# EAGLE design SumoDuino (EAGLE 7.1.0)
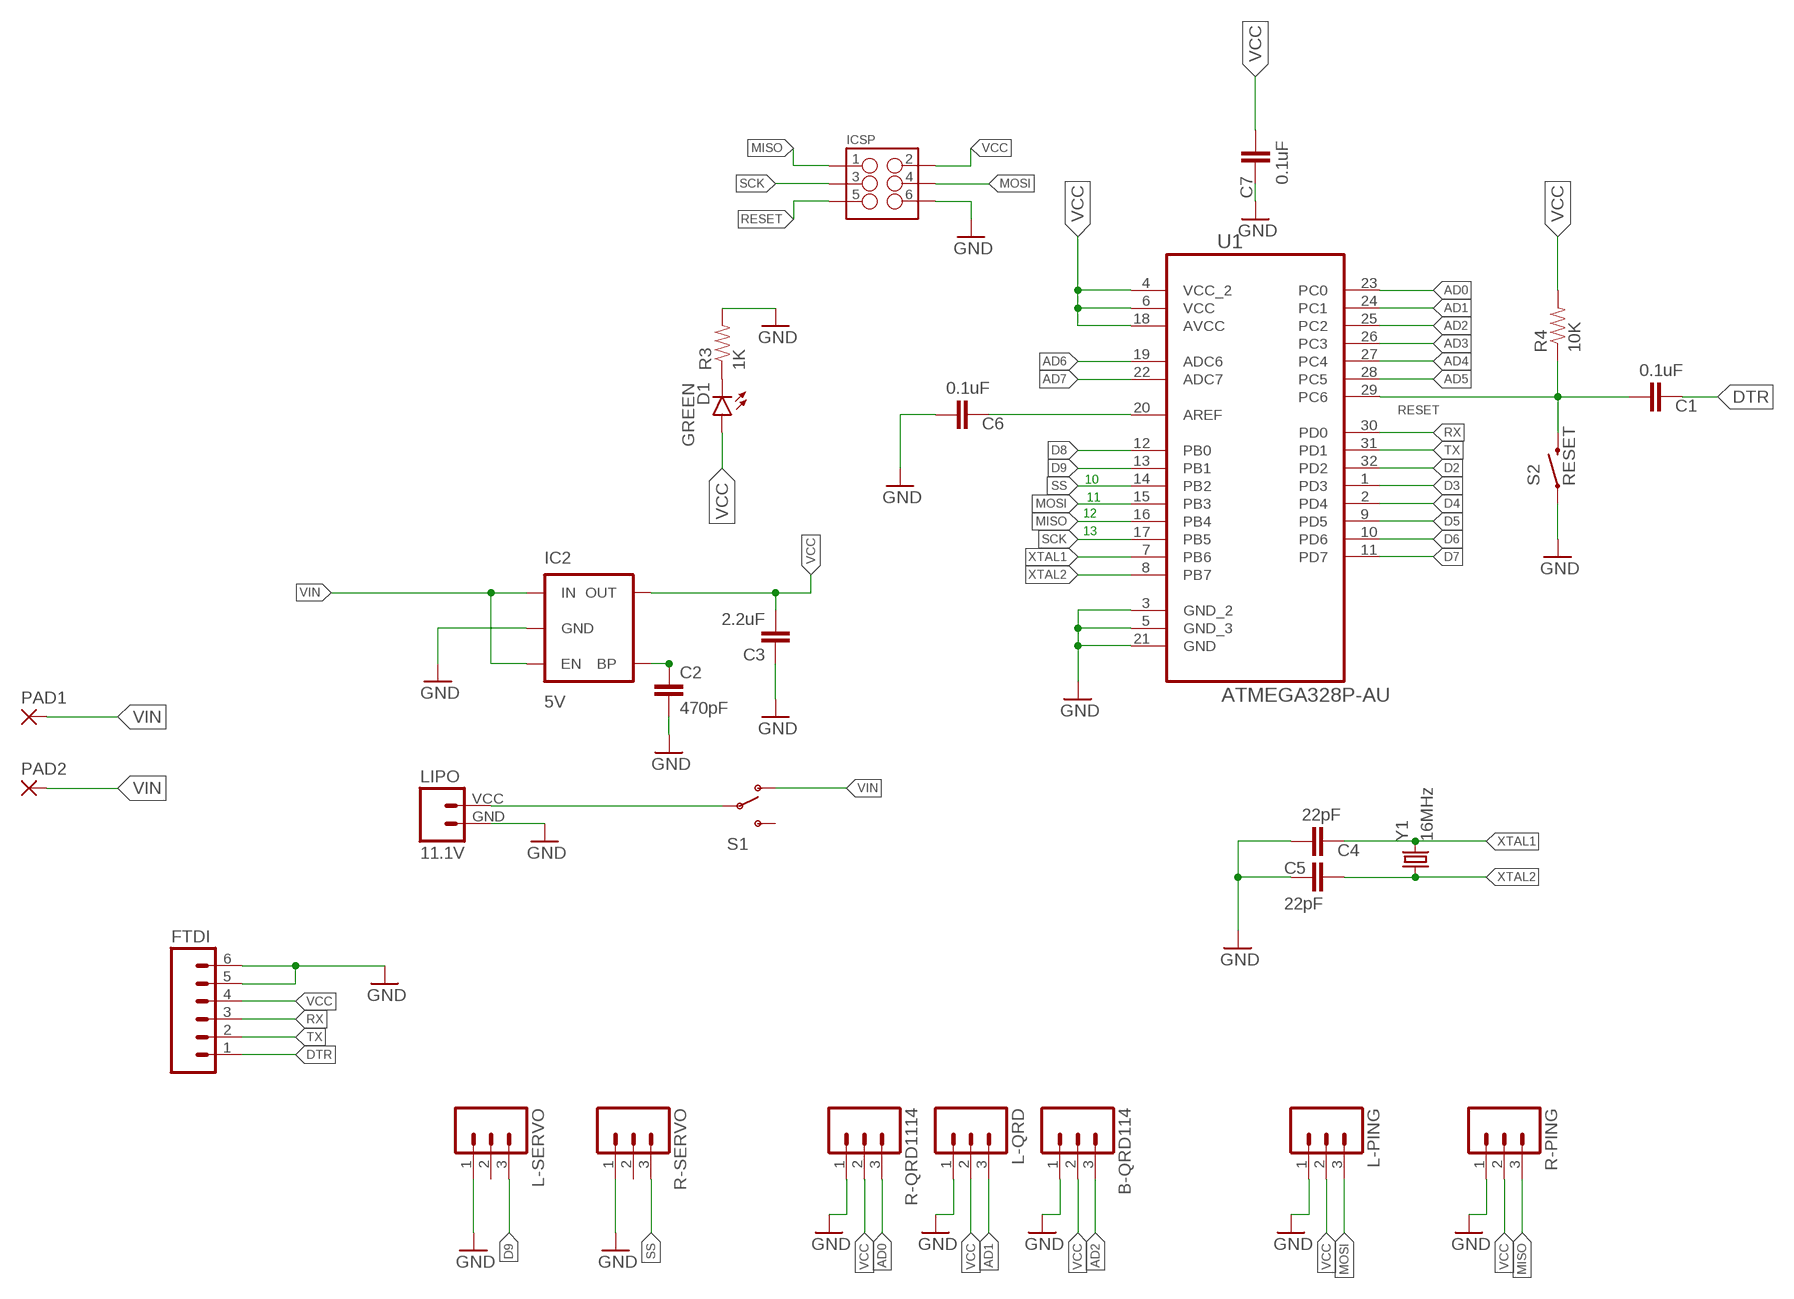
[diagram p0: schematic, sheet 1]

## Parts
B-QRD114  M03PTH  [1X03]
C1  0.1uF  CAP0603-CAP  [0603-CAP]
C2  470pF  CAP0603-CAP  [0603-CAP]
C3  2.2uF  CAP0603-CAP  [0603-CAP]
C4  22pF  CAP0603-CAP  [0603-CAP]
C5  22pF  CAP0603-CAP  [0603-CAP]
C6  0.1uF  CAP0603-CAP  [0603-CAP]
C7  0.1uF  CAP0603-CAP  [0603-CAP]
D1  GREEN  LED-GREEN0603  [LED-0603]
FTDI  M06LOCK  [1X06_LOCK]
IC2  5V  V_REG_MIC52055V  [SOT23-5]
ICSP  M03X22X3_SILK_MALE_PTH  [2X3]
L-PING  M03PTH  [1X03]
L-QRD  M03PTH  [1X03]
L-SERVO  M03PTH  [1X03]
LIPO  11.1V  M024UCON-15767  [JST-2-SMD-VERT]
PAD1  1,6/0,8  [1,6/0,8]
PAD2  1,6/0,8  [1,6/0,8]
R3  1K  RESISTOR0603  [0603-RES]
R4  10K  RESISTOR0603  [0603-RES]
R-PING  M03PTH  [1X03]
R-QRD1114  M03PTH  [1X03]
R-SERVO  M03PTH  [1X03]
S1  SWITCH-SPDTPTH  [SWITCH-SPDT]
S2  RESET  SWITCH-MOMENTARY-2PTH  [TACTILE-PTH]
U1  ATMEGA328P-AU  [QFP80P900X900X120-32N]
Y1  16MHz  CRYSTALHC49US  [HC49US]

## Nets
AD0: R-QRD1114.3 U1.23(PC0)
AD1: L-QRD.3 U1.24(PC1)
AD2: B-QRD114.3 U1.25(PC2)
AD3: U1.26(PC3)
AD4: U1.27(PC4)
AD5: U1.28(PC5)
AD6: U1.19(ADC6)
AD7: U1.22(ADC7)
D2: U1.32(PD2)
D3: U1.1(PD3)
D4: U1.2(PD4)
D5: U1.9(PD5)
D6: U1.10(PD6)
D7: U1.11(PD7)
D8: U1.12(PB0)
D9: L-SERVO.3 U1.13(PB1)
DTR: C1.1 FTDI.1
GND: B-QRD114.1 C2.2 C3.1 C4.2 C5.2 C6.2 C7.1 FTDI.5 FTDI.6 IC2.2(GND) ICSP.6 L-PING.1 L-QRD.1 L-SERVO.1 LIPO.GND R3.2 R-PING.1 R-QRD1114.1 R-SERVO.1 S2.1 U1.3(GND_2) U1.5(GND_3) U1.21(GND)
MISO: ICSP.1 R-PING.3 U1.16(PB4)
MOSI: ICSP.4 L-PING.3 U1.15(PB3)
N$4: LIPO.VCC S1.2(P)
N$5: D1.C R3.1
N$8: C2.1 IC2.4(BP)
N$27: C6.1 U1.20(AREF)
RESET: C1.2 ICSP.5 R4.1 S2.3 U1.29(PC6)
RX: FTDI.3 U1.30(PD0)
SCK: ICSP.3 U1.17(PB5)
SS: R-SERVO.3 U1.14(PB2)
TX: FTDI.2 U1.31(PD1)
VCC: B-QRD114.2 C3.2 C7.2 D1.A FTDI.4 IC2.5(OUT) ICSP.2 L-PING.2 L-QRD.2 R4.2 R-PING.2 R-QRD1114.2 U1.4(VCC_2) U1.6(VCC) U1.18(AVCC)
VIN: IC2.1(IN) IC2.3(EN) PAD1.1(P) PAD2.1(P) S1.1(O)
XTAL1: C4.1 U1.7(PB6) Y1.2
XTAL2: C5.1 U1.8(PB7) Y1.1
Unconnected: L-SERVO.2 R-SERVO.2 S1.3(S)

## Notes on the sheet
- 10
- 11
- 12
- 13

## Library data of the parts
B-QRD114 L-PING L-QRD L-SERVO R-PING R-QRD1114 R-SERVO = SparkFun-Connectors:M03: Header 3 Standard 3-pin 0.1" header. Use with straight break away headers (SKU : PRT-00116), right angle break away headers (PRT-00553), swiss pins (PRT-00743), machine pins (PRT-00117), and female headers (PRT-00115). Molex polarized connector foot print use with SKU : PRT-08232 with associated crimp pins and housings.
C1-C7 = SparkFun-Passives:CAP: Capacitor Standard 0603 ceramic capacitor, and 0.1" leaded capacitor.
D1 = SparkFun-LED:LED-GREEN: Various green LEDs Green LEDs used in SFE Production 0603- DIO-00821 LARGE- DIO-00862 LILYPAD- DIO-09910; PROD_ID: DIO-00821
FTDI = SparkFun-Connectors:M06: Header 6 Standard 6-pin 0.1" header. Use with straight break away headers (SKU : PRT-00116), right angle break away headers (PRT-00553), swiss pins (PRT-00743), machine pins (PRT-00117), and female headers (PRT-00115). Molex polarized connector foot print use with SKU : PRT-08094 with associated crimp pins and housings. NOTES ON THE VARIANTS LOCK and LOCK_LONGPADS... This footprint was designed to help hold the alignment of a through-hole component (i.e. 6-pin header) while soldering it into place. You may notice that each hole has been shifted either up or down by 0.005 of an inch from it's more standard position (which is a perfectly straight line). This slight alteration caused the pins (the squares in the middle) to touch the edges of the holes. Because they are alternating, it causes a "brace" to hold the component in place. 0.005 has proven to be the perfect amount of "off-center" position when using our standard breakaway headers. Although looks a little odd when you look at the bare footprint, once you have a header in there, the alteration is very hard to notice. Also,if you push a header all the way into place, it is covered up entirely on the bottom side. This idea of altering the position of holes to aid alignment will be further integrated into the Sparkfun Library for other footprints. It can help hold any component with 3 or more connection pins.
IC2 = SparkFun-PowerIC:V_REG_MIC5205: V_REG MIC5219 Standard 3.3V and 5V 150mA LDO voltage regulator in SOT-23 layout. Micrel part MIC5205. BP (by-pass) pin is used to lower output noise with 470pF cap, may be left open.; PROD_ID: VREG-00823
ICSP = SparkFun-Connectors:M03X2: 2x3 .1" header. Shrouded, with keying- CONN-10681 SMT- CONN-11415 Pogo pins- HW-11044; PROD_ID: CONN-09701
LIPO = SparkFun-Connectors:M02: Standard 2-pin 0.1" header. Use with - straight break away headers ( PRT-00116) - right angle break away headers (PRT-00553) - swiss pins (PRT-00743) - machine pins (PRT-00117) - female headers (PRT-00115) Molex polarized connector foot print use with: PRT-08233 with associated crimp pins and housings. 2.54_SCREWTERM for use with PRT-10571. 3.5mm Screw Terminal footprints for PRT-08084 5mm Screw Terminal footprints for use with PRT-08432
PAD1 PAD2 = wirepad:1,6/0,8: THROUGH-HOLE PAD
R3 R4 = SparkFun-Resistors:RESISTOR: Resistor Basic schematic elements and footprints for 0603, 1206, and PTH resistors.
S1 = SparkFun-Electromechanical:SWITCH-SPDT: SPDT Switch Simple slide switch, Spark Fun Electronics SKU : COM-00102 DPDT SMT slide switch, AYZ0202, SWCH-08179; PROD_ID: SWCH-08261
S2 = SparkFun-Electromechanical:SWITCH-MOMENTARY-2: Various NO switches- pushbuttons, reed, etc
U1 = Atmel_By_element14_Batch_1-00:ATMEGA328P-AU: 8-bit Microcontroller with In-System Programmable Flash; MPN: ATMEGA328P-AU; OC_FARNELL: 1715486; OC_NEWARK: 14R4631; PACKAGE: TQFP-32; SUPPLIER: Atmel
Y1 = SparkFun-FreqCtrl:CRYSTAL: Various standard crystals. Proven footprints.

## Board
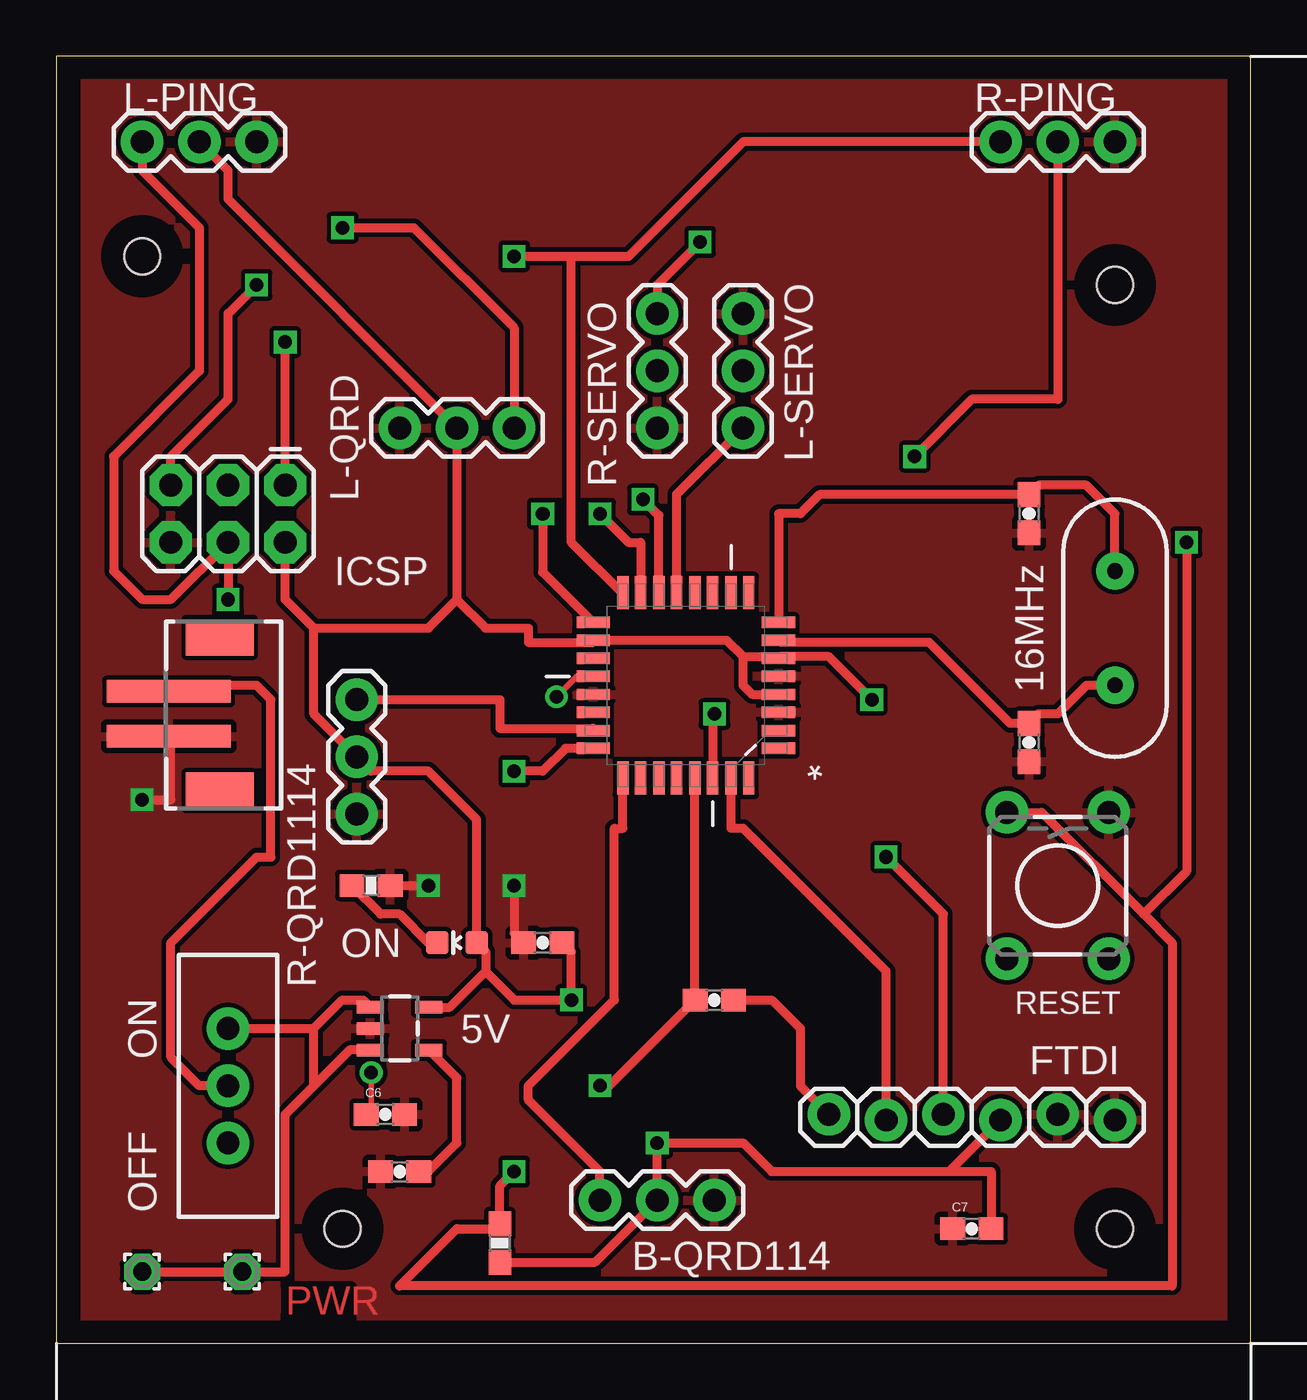
[diagram p1: board, top side]
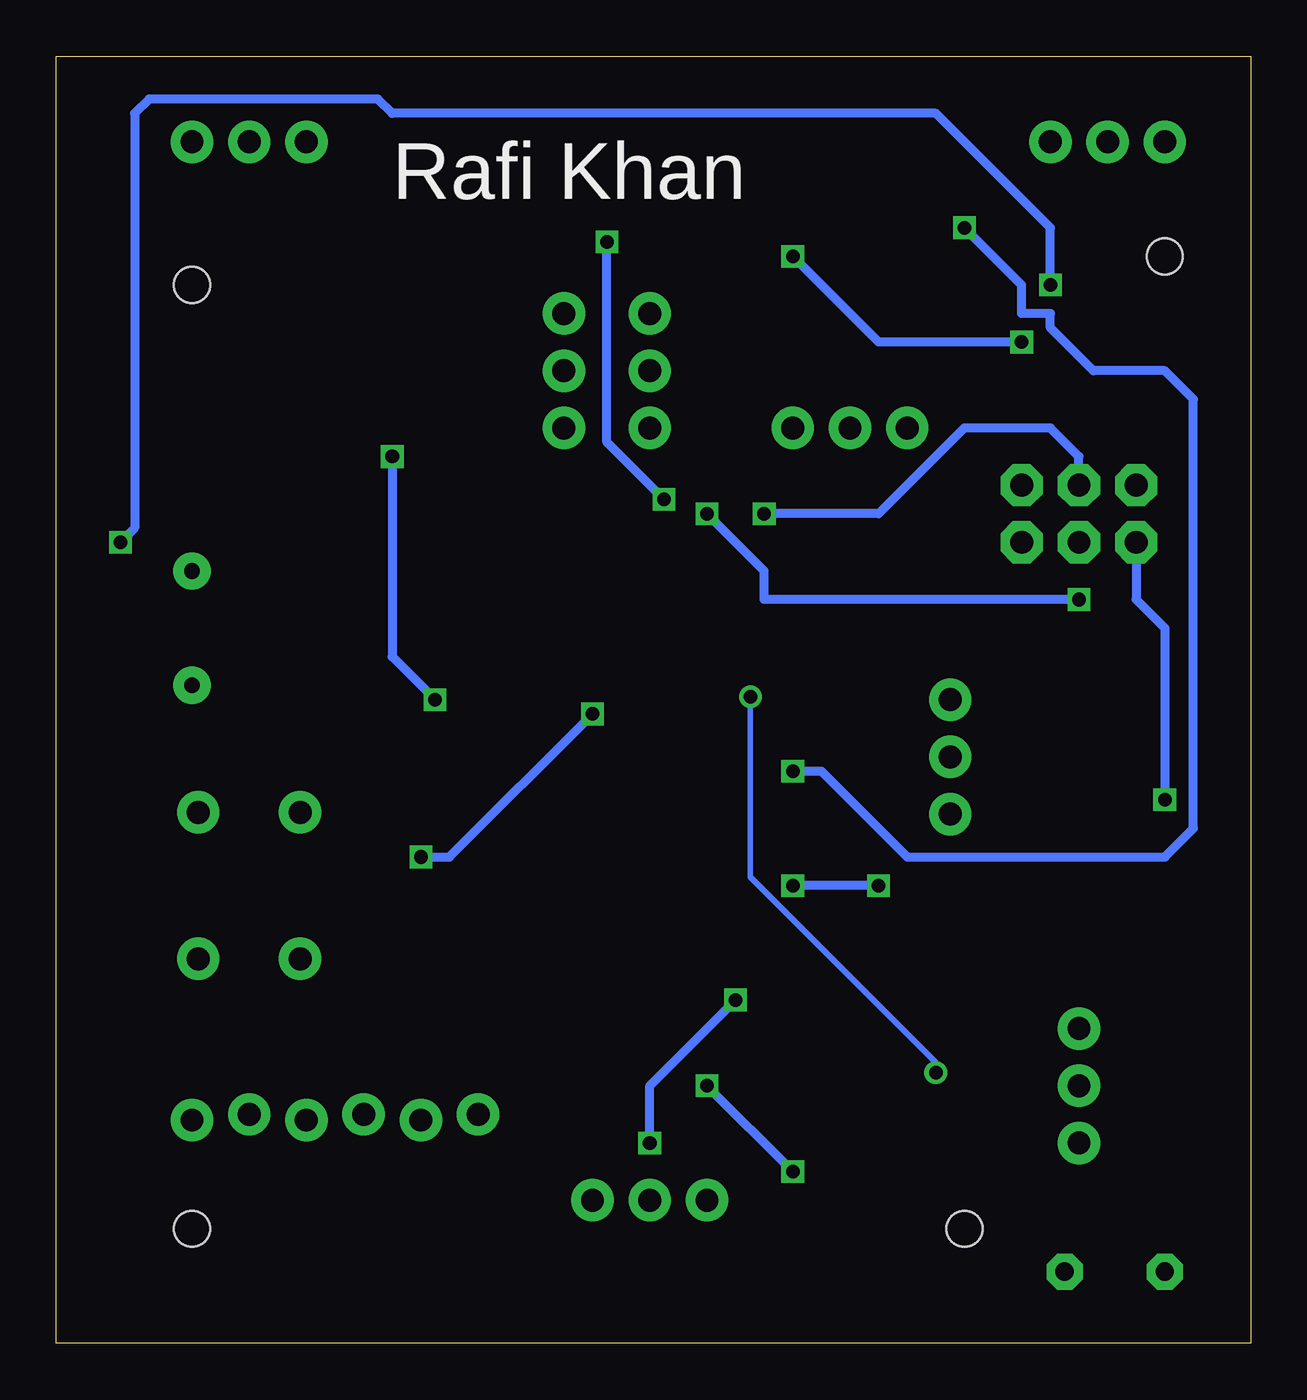
[diagram p2: board, bottom side, seen from below]

Size 53.01 x 57.14 mm. Coordinates in mm from the lower left corner, seen from the top.
Outline: 0,0 53.01,0 53.01,57.14 0,57.14 0,0
Copper layers (1*16): Top 0.035mm / dielectric 1.5mm / Bottom 0.035mm
Design rules "default": minimum track width 10mil, minimum drill 24mil, track to track 8mil, track to pad 8mil, pad to pad 8mil, via to via 8mil, smd to smd 8mil, copper to edge 40mil, drill to drill 8mil, minimum pad ring 10mil, minimum via ring 8mil, stop-mask expansion 4mil, vias tented up to drill 0mil, thermal gap 10mil
Holes 1.6 mm at 12.7,5.08 46.99,5.08 3.81,48.26 46.99,46.99

### Footprints (pad centres in the part's own frame; a part is rotated, then mirrored left to right if it is on the bottom)
1X03 = drill 1.016 pad 1.88: 1 0,0; 2 2.54,0; 3 5.08,0
0603-CAP = smd 1.1 x 1: 1 -0.85,0; 2 0.85,0
LED-0603 = smd 1 x 1: A 0,-0.877; C 0,0.877
1X06_LOCK = drill 1.016 pad 1.88: 1 0,0; 2 2.54,-0.254; 3 5.08,0; 4 7.62,-0.254; 5 10.16,0; 6 12.7,-0.254
SOT23-5 = smd 0.55 x 1.2: 1 -0.95,-1.3; 2 0,-1.3; 3 0.95,-1.3; 4 0.95,1.3; 5 -0.95,1.3
2X3 = drill 1.016 pad 1.88 octagon: 1 0,0; 2 0,2.54; 3 2.54,0; 4 2.54,2.54; 5 5.08,0; 6 5.08,2.54
JST-2-SMD-VERT = smd 1 x 5.5: GND 1,-2; VCC -1,-2 | smd 1.6 x 3: P$1 -3.4,0.27; P$2 3.4,0.27
1,6/0,8 = drill 0.813 pad 1.6 octagon: 1 0,0
0603-RES = smd 1.1 x 1: 1 -0.85,0; 2 0.85,0
SWITCH-SPDT = drill 1.016 pad 1.88: 1 0,2.54; 2 0,0; 3 0,-2.54
TACTILE-PTH = drill 1.016 pad 1.88: 1 -3.251,2.261; 2 3.251,2.261; 3 -3.251,-2.261; 4 3.251,-2.261
QFP80P900X900X120-32N = smd 1.473 x 0.508: 1 -4.115,2.794; 2 -4.115,2.007; 3 -4.115,1.194; 4 -4.115,0.406; 5 -4.115,-0.406; 6 -4.115,-1.194; 7 -4.115,-2.007; 8 -4.115,-2.794; 17 4.115,-2.794; 18 4.115,-2.007; 19 4.115,-1.194; 20 4.115,-0.406; 21 4.115,0.406; 22 4.115,1.194; 23 4.115,2.007; 24 4.115,2.794 | smd 0.508 x 1.473: 9 -2.794,-4.115; 10 -2.007,-4.115; 11 -1.194,-4.115; 12 -0.406,-4.115; 13 0.406,-4.115; 14 1.194,-4.115; 15 2.007,-4.115; 16 2.794,-4.115; 25 2.794,4.115; 26 2.007,4.115; 27 1.194,4.115; 28 0.406,4.115; 29 -0.406,4.115; 30 -1.194,4.115; 31 -2.007,4.115; 32 -2.794,4.115
HC49US = drill 0.7 pad 1.651: 1 -2.54,0; 2 2.54,0

### Placement (x,y rotation side)
B-QRD114  29.21,6.35 180 top
C1  29.21,15.24 180 top
C2  15.24,7.62 180 top
C3  21.59,17.78 0 top
C4  43.18,26.67 270 top
C5  43.18,36.83 270 top
C6  14.61,10.16 0 top
C7  40.64,5.08 0 top
D1  17.78,17.78 90 top
FTDI  34.29,10.16 0 top
IC2  15.24,13.97 270 top
ICSP  10.16,38.1 180 top
L-PING  8.89,53.34 180 top
L-QRD  15.24,40.64 0 top
L-SERVO  30.48,45.72 270 top
LIPO  6.99,27.94 270 top
PAD1  3.81,3.17 0 top
PAD2  8.25,3.17 0 top
R3  13.97,20.32 0 top
R4  19.68,4.45 270 top
R-PING  46.99,53.34 180 top
R-QRD1114  13.34,23.5 90 top
R-SERVO  26.67,40.64 90 top
S1  7.62,11.43 0 top
S2  44.45,20.32 270 top
U1  27.94,29.21 180 top
Y1  46.99,31.75 270 top

### Tracks (layer width: path | path; a pad name or v marks a point on that pad's centre or on a via)
AD0
  Top 0.406: R-QRD1114.3 19.68,28.57 19.68,27.3 23.82,27.3 U1.23
AD1  (via drill 0.6)
  Top 0.406: U1.24 22.61,26.42 21.59,25.4 v20.32,25.4 | v12.7,49.53 15.88,49.53 20.32,45.09 L-QRD.3
  Bottom 0.406: v20.32,25.4 19.05,25.4 15.24,21.59 3.81,21.59 2.54,22.86 2.54,41.91 3.81,43.18 6.99,43.18 8.89,45.09 8.89,45.72 10.16,45.72 10.16,46.99 v12.7,49.53
AD2
  Top 0.406: B-QRD114.3 24.13,7.62 20.95,10.79 20.95,11.43 24.77,15.24 24.77,22.86 25.15,22.86 U1.25
D9
  Top 0.406: U1.13 27.53,37.69 L-SERVO.3
DTR
  Top 0.406: C1.1 31.75,15.24 33.02,13.97 33.02,11.43 FTDI.1
GND  (via drill 0.6)
  Top 0.406: R3.2 v16.51,20.32 | v20.32,20.32 20.32,18.2 C3.1 | v3.81,24.13 5.08,24.13 5.08,26.84 LIPO.GND
  Bottom 0.406: v16.51,20.32 v20.32,20.32 | ICSP.6 5.08,33.02 3.81,31.75 v3.81,24.13
  pour Top: 1.27,82.55 1.27,-2.54 105.41,-2.54 105.41,82.55
MISO  (via drill 0.6)
  Top 0.406: R-PING.3 30.48,53.34 25.4,48.26 22.86,48.26 | ICSP.1 v10.16,44.45 | v20.32,48.26 22.86,48.26 | U1.16 25.09,33.33 22.86,35.56 22.86,48.26
  Bottom 0.406: v10.16,44.45 16.51,44.45 v20.32,48.26
MOSI  (via drill 0.6)
  Top 0.406: L-PING.3 3.81,52.07 6.35,49.53 6.35,43.18 2.54,39.37 2.54,34.29 3.81,33.02 5.08,33.02 ICSP.4 v7.62,33.02 | v24.13,36.83 25.4,35.56 25.93,35.56 U1.15
  Bottom 0.406: v7.62,33.02 21.59,33.02 21.59,34.29 v24.13,36.83
N$4
  Top 0.406: S1.2 6.35,11.43 5.08,12.7 5.08,17.78 8.89,21.59 9.53,21.59 9.53,28.57 8.89,29.21 5.25,29.21 LIPO.VCC 5.08,28.84
N$5
  Top 0.406: D1.C 16.51,17.78 15.24,19.05 14.39,19.05 R3.1
N$8
  Top 0.406: C2.1 16.51,7.62 17.78,8.89 17.78,11.78 IC2.4
N$27  (via drill 0.61)
  Top 0.254: v13.97,12.01 13.97,10.18 C6.1 | v22.2,28.7 23.11,29.62 U1.20
  Bottom 0.254: v13.97,12.01 13.97,12.47 22.2,20.7 v22.2,28.7
RESET  (via drill 0.6)
  Top 0.406: v20.32,7.62 19.68,6.98 R4.1 19.47,5.08 17.78,5.08 15.24,2.54 49.53,2.54 49.53,17.78 48.26,19.05 | v24.13,11.43 24.55,11.43 C1.2 28.35,15.24 U1.29 | S2.3 43.74,23.57 48.26,19.05 | ICSP.5 5.08,39.37 7.62,41.91 7.62,45.72 v8.89,46.99 | v50.16,35.56 50.16,20.95 48.26,19.05
  Bottom 0.406: v20.32,7.62 v24.13,11.43 | v8.89,46.99 8.89,49.53 13.97,54.61 38.1,54.61 38.73,55.25 48.89,55.25 49.53,54.61 49.53,36.2 v50.16,35.56
RX  (via drill 0.6)
  Top 0.406: FTDI.3 39.37,19.05 v36.83,21.59 | v29.21,27.94 29.13,27.94 U1.30
  Bottom 0.406: v36.83,21.59 35.56,21.59 v29.21,27.94
SCK  (via drill 0.6)
  Top 0.406: v21.59,36.83 21.59,34.24 U1.17
  Bottom 0.406: ICSP.3 7.62,39.37 8.89,40.64 12.7,40.64 16.51,36.83 v21.59,36.83
SS  (via drill 0.6)
  Top 0.406: U1.14 26.75,36.75 v26.04,37.47 | v28.57,48.9 26.67,46.99 R-SERVO.3
  Bottom 0.406: v26.04,37.47 28.57,40.01 v28.57,48.9
TX
  Top 0.406: FTDI.2 36.83,16.51 30.48,22.86 29.95,22.86 U1.31
VCC  (via drill 0.6)
  Top 0.406: R4.2 23.91,3.6 B-QRD114.2 v26.67,8.89 30.48,8.89 31.75,7.62 39.62,7.62 | C3.2 22.86,17.36 v22.86,15.24 20.32,15.24 19.05,16.51 | 39.62,7.62 FTDI.4 | 30.48,30.48 30.48,29.21 30.89,28.8 U1.4 | 30.48,30.48 32.05,30.48 U1.6 32.13,30.48 34.29,30.48 v36.2,28.57 | R-PING.2 44.45,41.91 40.64,41.91 v38.1,39.37 | 30.48,30.48 29.74,31.22 U1.18 23.82,31.11 20.95,31.11 20.95,31.75 19.05,31.75 17.78,33.02 | IC2.5 17.46,14.92 19.05,16.51 | 19.05,16.51 19.05,17.39 D1.A 18.66,23.25 16.51,25.4 13.97,25.4 R-QRD1114.2 11.43,27.94 11.43,31.75 | 11.43,31.75 10.16,33.02 ICSP.2 | L-PING.2 7.62,52.07 7.62,50.8 L-QRD.2 17.78,33.02 | 11.43,31.75 16.51,31.75 17.78,33.02 | 39.62,7.62 41.49,7.62 C7.2
  Bottom 0.406: v26.67,8.89 26.67,11.43 v22.86,15.24 | v38.1,39.37 38.1,30.48 v36.2,28.57
VIN
  Top 0.406: S1.1 11.43,13.97 | 11.43,13.97 12.7,15.24 13.62,15.24 IC2.1 | IC2.3 13.02,13.02 11.43,11.43 | 11.43,11.43 11.43,13.97 | PAD2.1 PAD1.1 10.16,3.17 10.16,10.16 11.43,11.43
XTAL1
  Top 0.406: Y1.2 45.72,29.21 44.45,27.94 43.6,27.94 C4.1 42.33,27.52 38.73,31.11 32.16,31.11 U1.7
XTAL2
  Top 0.406: Y1.1 46.99,36.83 45.72,38.1 43.6,38.1 C5.1 33.87,37.68 33.02,36.83 32.05,36.83 U1.8

### Text on the board
Top: PWR
tPlace: 16MHz | ON | ON | 5V | RESET | OFF
bPlace: Rafi Khan